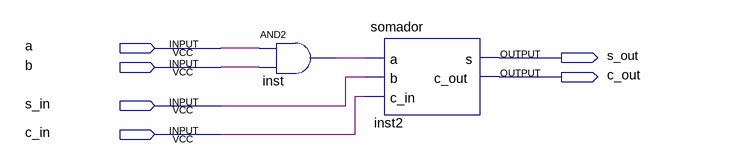
[diagram p0: schematic sheet]
// Quartus schematic multiplicador.bdf as structural Verilog: 2 symbols, 6 pins
module multiplicador (
  input  a,
  input  b,
  input  s_in,
  input  c_in,
  output s_out,
  output c_out
);

  wire inst_out;

  and inst (inst_out, a, b);
  somador inst2 (.a(inst_out), .b(s_in), .c_in(c_in), .s(s_out), .c_out(c_out));
endmodule
